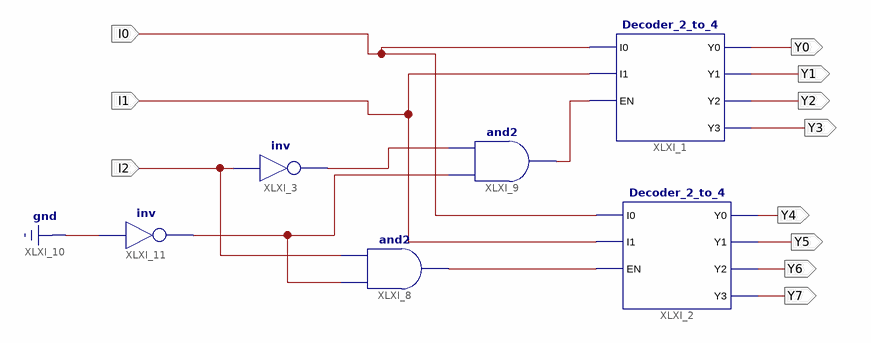
[diagram p0: schematic sheet 1]
// Xilinx ISE schematic Decoder_3_8.sch (spartan3e) as structural Verilog: 6 symbols, 11 ports
module Decoder_3_8 (
  input  I0,
  input  I1,
  input  I2,
  output Y0,
  output Y1,
  output Y2,
  output Y3,
  output Y4,
  output Y5,
  output Y7,
  output Y6
);

  wire EN, XLXN_66, XLXN_67, XLXN_69;

  not XLXI_3 (XLXN_69, I2);
  Decoder_2_to_4 XLXI_1 (.EN(XLXN_66), .I0(I0), .I1(I1), .Y0(Y0), .Y1(Y1), .Y2(Y2), .Y3(Y3));
  Decoder_2_to_4 XLXI_2 (.EN(XLXN_67), .I0(I0), .I1(I1), .Y0(Y4), .Y1(Y5), .Y2(Y6), .Y3(Y7));
  and XLXI_8 (XLXN_67, EN, I2);
  and XLXI_9 (XLXN_66, EN, XLXN_69);
  not XLXI_11 (EN, 1'b0);
endmodule
